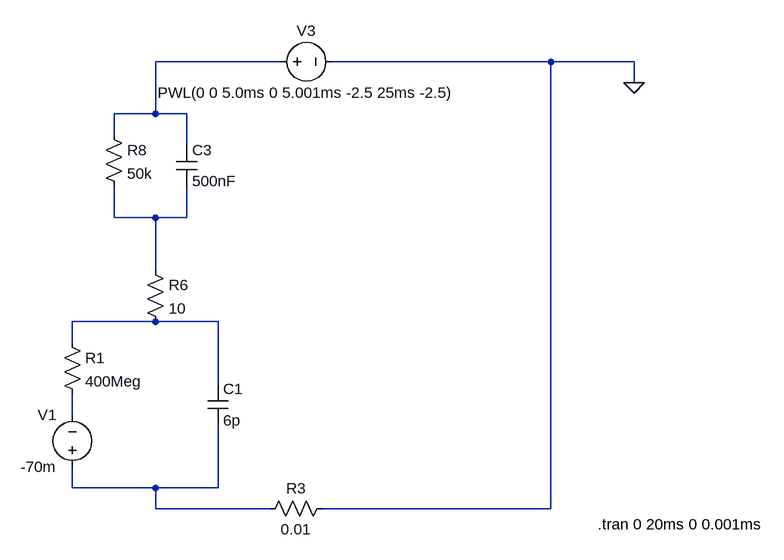
[diagram p0: schematic 電圧刺激等価回路_論文用_20210121_minimam.asc]
電圧刺激等価回路_論文用_20210121_minimam.asc, the LTspice schematic file:
Version 4
SHEET 1 1992 680
WIRE 320 -368 128 -368
WIRE 736 -368 400 -368
WIRE 864 -368 736 -368
WIRE 864 -336 864 -368
WIRE 128 -288 128 -368
WIRE 128 -288 64 -288
WIRE 176 -288 128 -288
WIRE 64 -256 64 -288
WIRE 176 -240 176 -288
WIRE 64 -128 64 -176
WIRE 128 -128 64 -128
WIRE 176 -128 176 -176
WIRE 176 -128 128 -128
WIRE 128 -48 128 -128
WIRE 128 32 0 32
WIRE 224 32 128 32
WIRE 0 64 0 32
WIRE 224 128 224 32
WIRE 0 176 0 144
WIRE 0 288 0 256
WIRE 128 288 0 288
WIRE 224 288 224 192
WIRE 224 288 128 288
WIRE 128 320 128 288
WIRE 304 320 128 320
WIRE 736 320 736 -368
WIRE 736 320 384 320
FLAG 864 -336 0
SYMBOL voltage 304 -368 R270
WINDOW 0 32 56 VTop 2
WINDOW 3 -32 56 VBottom 2
WINDOW 123 0 0 Left 0
WINDOW 39 0 0 Left 0
SYMATTR InstName V3
SYMATTR Value PWL(0 0 5.0ms 0 5.001ms -2.5 25ms -2.5)
SYMBOL res -16 48 R0
SYMATTR InstName R1
SYMATTR Value 400Meg
SYMBOL res 400 304 R90
WINDOW 0 0 56 VBottom 2
WINDOW 3 32 56 VTop 2
SYMATTR InstName R3
SYMATTR Value 0.01
SYMBOL res 112 -64 R0
SYMATTR InstName R6
SYMATTR Value 10
SYMBOL cap 208 128 R0
SYMATTR InstName C1
SYMATTR Value 6p
SYMBOL cap 160 -240 R0
SYMATTR InstName C3
SYMATTR Value 500nF
SYMBOL res 48 -272 R0
SYMATTR InstName R8
SYMATTR Value 50k
SYMBOL voltage 0 272 R180
WINDOW 0 24 96 Left 2
WINDOW 3 24 16 Left 2
SYMATTR InstName V1
SYMATTR Value -70m
TEXT 808 344 Left 2 !.tran 0 20ms 0 0.001ms

The netlist it stands for:
* 電圧刺激等価回路_論文用_20210121_minimam.asc
V3 N001 0 PWL(0 0 5.0ms 0 5.001ms -2.5 25ms -2.5)
R1 N003 N004 400Meg
R3 0 N005 0.01
R6 N002 N003 10
C1 N003 N005 6p
C3 N001 N002 500nF
R8 N001 N002 50k
V1 N005 N004 -70m
.tran 0 20ms 0 0.001ms
.backanno
.end